# Altium project Fader Project.PrjPcb
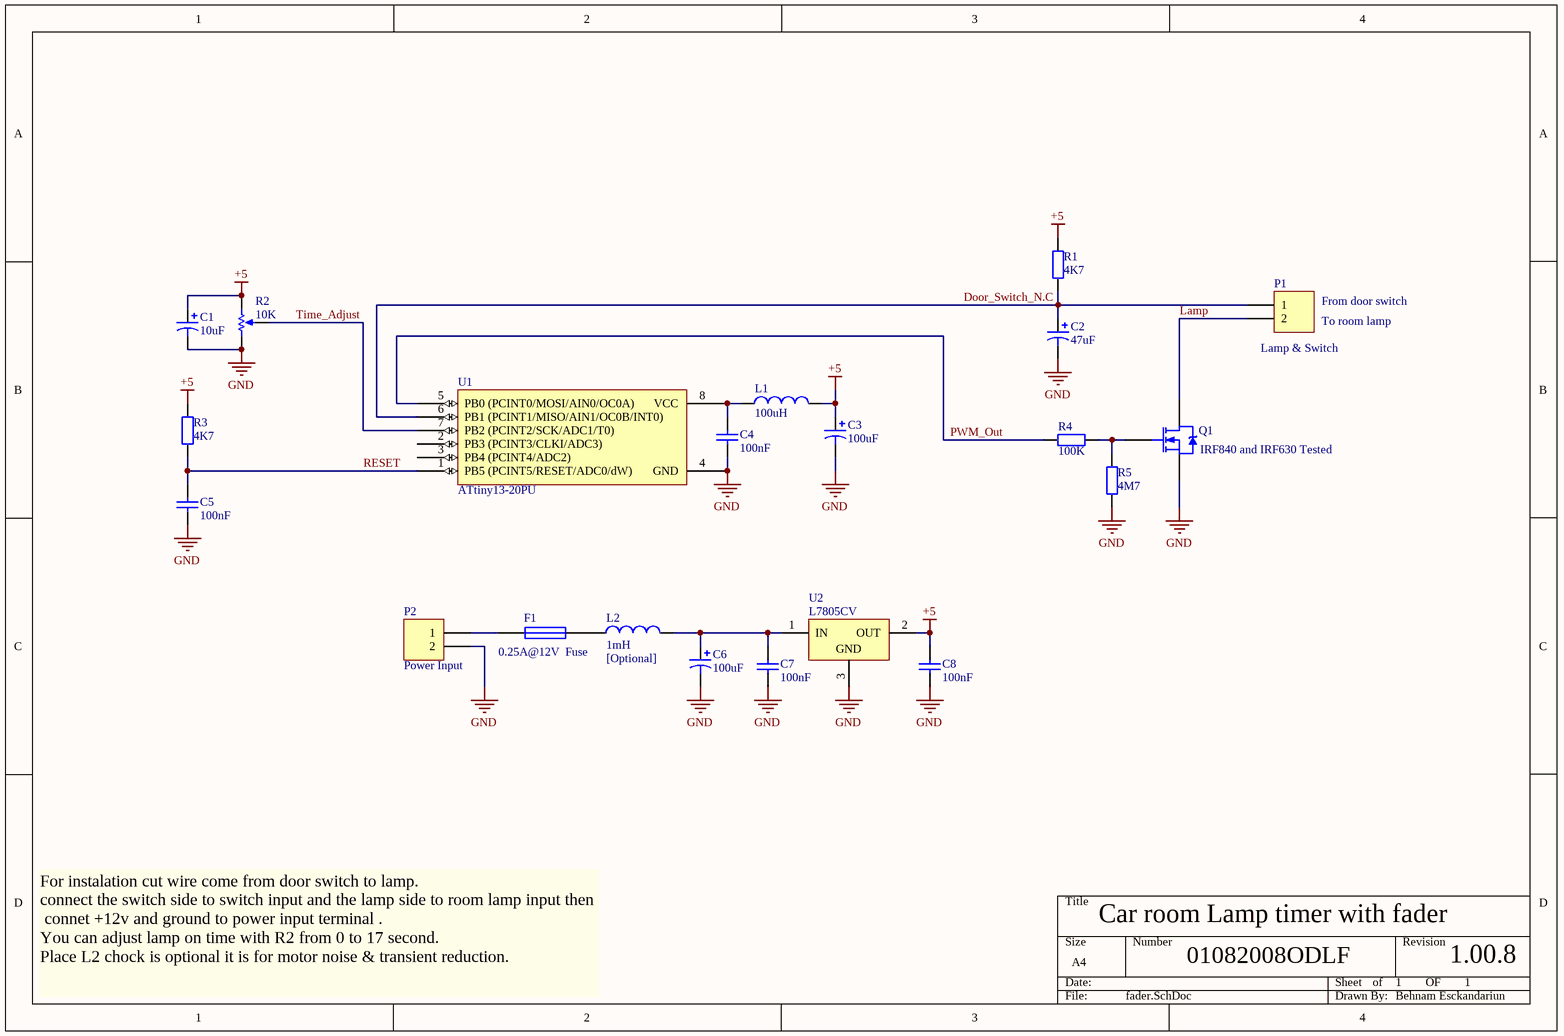
[diagram p0: fader.SchDoc]
1 sheet, 21 parts. Net scope: global (net labels, ports and power ports of the same name join across sheets).
Board file: Lamp fader.PcbDoc

## Sheet fader.SchDoc
size A4

### Parts
C1  value 10uF  [CAPPR2-5X6.8]  (hidden comment: Cap Pol1)
C2  value 47uF  [CAPPR2-5X6.8]  (hidden comment: Cap Pol1)
C3  value 100uF  [CAPPR2-5X6.8]  (hidden comment: Cap Pol1)
C4  value 100nF  [rad-0.1]  (hidden comment: Cap)
C5  value 100nF  [rad-0.1]  (hidden comment: Cap)
C6  value 100uF  [CAPPR2-5X6.8]  (hidden comment: Cap Pol1)
C7  value 100nF  [rad-0.1]  (hidden comment: Cap)
C8  value 100nF  [rad-0.1]  (hidden comment: Cap)
F1  0.25A@12V  Fuse  [AXIAL-0.4]
L1  value 100uH  [axial-0.4]  (hidden comment: Inductor)
L2  [Optional]  value 1mH  [axial-0.3]
P1  Lamp & Switch  [Cannector-2]
P2  Power Input  [Cannector-2]
Q1  IRF840 and IRF630 Tested  [TO-220AB]
R1  value 4K7  [AXIAL-0.4]  (hidden comment: Res2)
R2  value 10K  [VR4]  (hidden comment: RPot)
R3  value 4K7  [AXIAL-0.4]  (hidden comment: Res2)
R4  value 100K  [AXIAL-0.4]  (hidden comment: Res2)
R5  value 4M7  [AXIAL-0.4]  (hidden comment: Res2)
U1  ATtiny13-20PU  [DIP-8]
U2  L7805CV  [TO220ABN]

### Nets
+5: C1.1 C3.1 C8.1 L1.2 R1.2 R2.2(BOT) R3.2 U2.2(OUT)
GND: C1.2 C2.2 C3.2 C4.2 C5.2 C6.2 C7.2 C8.2 P2.2 Q1.3(S) R2.1(TOP) R5.2 U1.4(GND) U2.3(GND)
Door_Switch_N.C: C2.1 P1.1 R1.1 U1.6(PB1_(PCINT1/MISO/AIN1/OC0B/INT0))
Lamp: P1.2 Q1.2(D)
PWM_Out: R4.2 U1.5(PB0_(PCINT0/MOSI/AIN0/OC0A))
RESET: C5.1 R3.1 U1.1(PB5_(PCINT5/RESET/ADC0/dW))
Time_Adjust: R2.3(TAP) U1.7(PB2_(PCINT2/SCK/ADC1/T0))
NetC4_1: C4.1 L1.1 U1.8(VCC)
NetC6_1: C6.1 C7.1 L2.2 U2.1(IN)
NetF1_1: F1.1 P2.1
NetF1_2: F1.2 L2.1
NetQ1_1: Q1.1(G) R4.1 R5.1

Not connected (* = marked no-connect by the designer): U1 2(PB3_(PCINT3/CLKI/ADC3)) 3(PB4_(PCINT4/ADC2))

### Notes on the sheet
- (near P1) From door switch
- (near P1) To room lamp
- Car room Lamp timer with fader
- 01082008ODLF
- 1        OF        1
- 1.00.8
- For instalation cut wire come from door switch to lamp.
  connect the switch side to switch input and the lamp side to room lamp input then
  connet +12v and ground to power input terminal .
  You can adjust lamp on time with R2 from 0 to 17 second.
  Place L2 chock is optional it is for motor noise & transient reduction.
  ENJOY IT!
- Behnam Esckandariun

### Library data of the parts
C1-C3 C6 = Cap Pol1: Polarized Capacitor (Radial); Published: 8-Jun-2000; LatestRevisionDate: 17-Jul-2002; LatestRevisionNote: Re-released for DXP Platform.; PackageReference: RB7.6-15; Publisher: Altium Limited
C4 C5 C7 C8 = Cap: Capacitor; Published: 8-Jun-2000; LatestRevisionDate: 17-Jul-2002; LatestRevisionNote: Re-released for DXP Platform.; PackageReference: RAD-0.3; Publisher: Altium Limited
F1 = Fuse 1: Fuse; Published: 8-Jun-2000; LatestRevisionDate: 17-Jul-2002; LatestRevisionNote: Re-released for DXP Platform.; PackageReference: PIN-W2/E2.8; Publisher: Altium Limited
L1 L2 = Inductor: Code_IEC: 1005; Published: 8-Jun-2000; LatestRevisionDate: 17-Jul-2002; LatestRevisionNote: Re-released for DXP Platform.; PackageReference: 0402-A; Publisher: Altium Limited; Code_JEITA: 0402
P1 P2 = Header 2: Header, 2-Pin; LatestRevisionDate: 17-Jul-2002; LatestRevisionNote: Re-released for DXP Platform.; Publisher: Altium Limited
Q1 = IRF840: HEXFET N-Channel Power MOSFET; Note: Pin 2 is electrically connected to pin 4.; Published: 8-Jun-2000; LatestRevisionDate: 17-Jul-2002; LatestRevisionNote: Re-released for DXP Platform.; DatasheetVersion: PD-9.376H; PackageVersion: Feb-1997; PackageReference: TO-220AB; Publisher: Altium Limited; PackageDescription: TO, Thru-Hole, Vertical, Heatsink Mounted; 3 In-Line Leads; Pitch 2.54 mm; ComponentLink1Description: Manufacturer Link; ComponentLink1URL: http://www.irf.com/; ComponentLink2Description: Datasheet; ComponentLink2URL: http://www.irf.com/product-info/datasheets/data/irf840.pdf
R1 R3-R5 = Res2: Resistor; Published: 8-Jun-2000; LatestRevisionDate: 17-Jul-2002; LatestRevisionNote: Re-released for DXP Platform.; PackageReference: AXIAL-0.4; Publisher: Altium Limited
R2 = RPot: Potentiometer; Sim Note: Enter the Resistance value and the set point into parameter fields.; Set Position: 0.5; Published: 8-Jun-2000; LatestRevisionDate: 17-Jul-2002; LatestRevisionNote: Re-released for DXP Platform.; PackageReference: VR5; Publisher: Altium Limited
U1 = ATtiny13-20PI: Atmel AVR 8-Bit Microcontroller
U2 = L7805CV: Positive Voltage Regulator; Note: Tab is connected to pin 3 (GND).; Published: 24-Aug-2001; LatestRevisionDate: 17-Jul-2002; LatestRevisionNote: Re-released for DXP Platform.; DatasheetVersion: Dec-1998; PackageVersion: Jun-1998; PackageReference: TO220ABN; Publisher: Altium Limited; PackageDescription: TO, Thru-Hole, Vertical, Heatsink Mounted; 3 In-Line Leads; Pitch 2.54 mm; Pin sequence 1, 3, 2; ComponentLink1Description: Manufacturer Link; ComponentLink1URL: http://www.st.com/